# Altium project Master_Project.PrjPcb
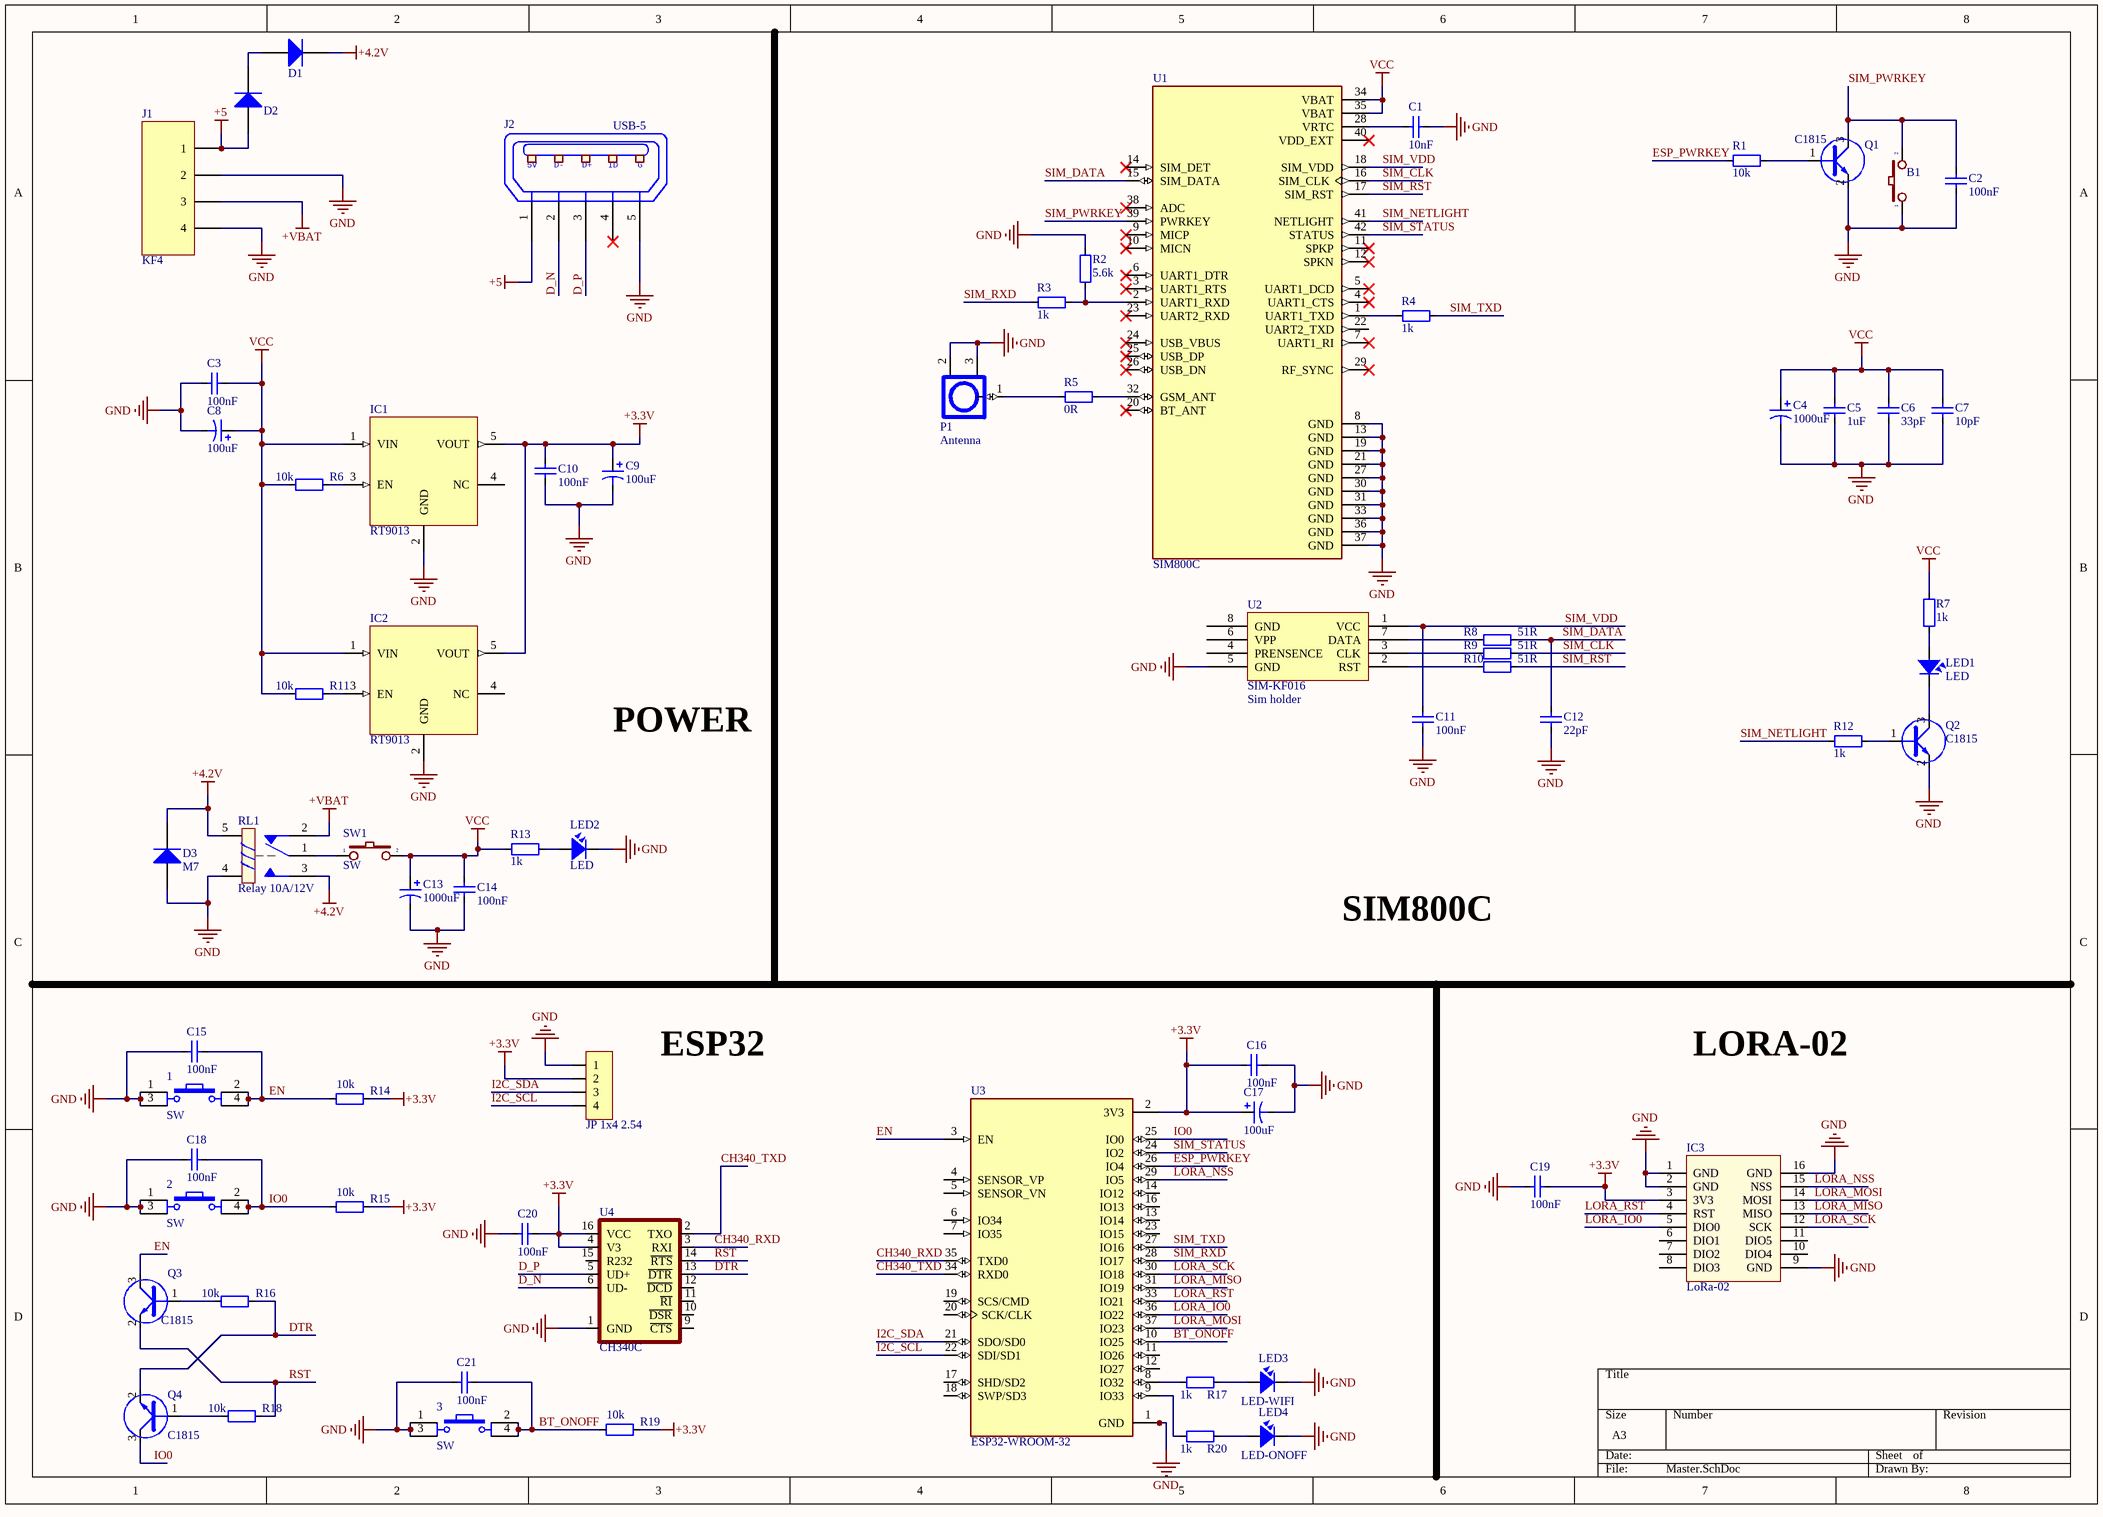
[diagram p0: Master.SchDoc]
1 sheet, 69 parts. Net scope: global (net labels, ports and power ports of the same name join across sheets).
Board file: Master.PcbDoc

## Sheet Master.SchDoc
size A3; SheetNumber: 1; SheetTotal: 1

### Parts
1  SW  [SW4]
2  SW  [SW4]
3  SW  [SW4]
B1  Button 3x4x2.5  [Button 3x4x2.5]  (value not drawn)
C1  10nF  [CAP_0805]
C2  100nF  [CAP_0805]
C3  100nF  [CAP_0805]
C4  1000uF  [C8mm]
C5  1uF  [CAP_0805]
C6  33pF  [CAP_0805]
C7  10pF  [CAP_0805]
C8  100uF  [C5mm]
C9  100uF  [C5mm]
C10  100nF  [CAP_0805]
C11  100nF  [CAP_0805]
C12  22pF  [CAP_0805]
C13  1000uF  [C8mm]
C14  100nF  [CAP_0805]
C15  100nF  [CAP_0805]
C16  100nF  [CAP_0805]
C17  100uF  [C5mm]
C18  100nF  [CAP_0805]
C19  100nF  [CAP_0805]
C20  100nF  [CAP_0805]
C21  100nF  [CAP_0805]
D1  SS34 Diode 3A 40V  [DIODE SMA]  (value not drawn)
D2  SS34 Diode 3A 40V  [DIODE SMA]  (value not drawn)
D3  M7  [DIODE SMA]
IC1  RT9013  [SOT23-5]
IC2  RT9013  [SOT23-5]
IC3  LoRa-02  [LoRa-02]
J1  KF4  [KF4-5.08]
J2  USB-5  [USB-M1]
JP1  JP 1x4 2.54  [JP 1x4 DT]
LED1  LED  [LED-0805-Red]
LED2  LED  [LED-0805-Red]
LED3  LED-WIFI  [LED-0805-Red]
LED4  LED-ONOFF  [LED-0805-Red]
P1  Antenna  [IPXS]
Q1  C1815  [SOT23D]
Q2  C1815  [SOT23D]
Q3  C1815  [SOT23D]
Q4  C1815  [SOT23D]
R1  10k  [RES-SMD-0805]
R2  5.6k  [RES-SMD-0805]
R3  1k  [RES-SMD-0805]
R4  1k  [RES-SMD-0805]
R5  0R  [RES-SMD-0805]
R6  10k  [RES-SMD-0805]
R7  1k  [RES-SMD-0805]
R8  51R  [RES-SMD-0805]
R9  51R  [RES-SMD-0805]
R10  51R  [RES-SMD-0805]
R11  10k  [RES-SMD-0805]
R12  1k  [RES-SMD-0805]
R13  1k  [RES-SMD-0805]
R14  10k  [RES-SMD-0805]
R15  10k  [RES-SMD-0805]
R16  10k  [RES-SMD-0805]
R17  1k  [RES-SMD-0805]
R18  10k  [RES-SMD-0805]
R19  10k  [RES-SMD-0805]
R20  1k  [RES-SMD-0805]
RL1  Relay 10A/12V  [RELAY 5]
SW1  SW  [SW2]
U1  SIM800C  [SIM800C]
U2  SIM-KF016  value Sim holder  [Sim Socket]
U3  ESP32-WROOM-32  [MODULE_ESP32-WROOM-32]
U4  CH340C  [SO016]

### Nets
+3.3V: C9.1 C10.1 C16.1 C17.1 C19.1 C20.2 IC1.5(VOUT) IC2.5(VOUT) IC3.3(3V3) JP1.2 R14.1 R15.1 R19.1 U3.2(3V3) U4.4(V3) U4.16(VCC)
+4.2V: D1.2(K) D3.2(K) RL1.3 RL1.5
+5: D2.1(A) J1.1 J2.1(P1)
+VBAT: J1.3 RL1.2
GND: 1.1 1.3 2.1 2.3 3.1 3.3 B1.1 C1.2 C2.1 C3.2 C4.2 C5.2 C6.2 C7.2 C8.2 C9.2 C10.2 C11.2 C12.1 C13.2 C14.2 C15.1 C16.2 C17.2 C18.1 C19.2 C20.1 C21.1 D3.1(A) IC1.2(GND) IC2.2(GND) IC3.1(GND) IC3.2(GND) IC3.9(GND) IC3.16(GND) J1.2 J1.4 J2.5(P5) JP1.1 LED2.2 LED3.2 LED4.2 P1.2 P1.3 Q1.2(E) Q2.2(E) R2.1 RL1.4 U1.8(GND) U1.13(GND) U1.19(GND) U1.21(GND) U1.27(GND) U1.30(GND) U1.31(GND) U1.33(GND) U1.36(GND) U1.37(GND) U2.5(GND) U3.1(GND) U3.15(GND) U3.38(GND) U3.39_1(GND) U3.39_2(GND) U3.39_3(GND) U3.39_4(GND) U3.39_5(GND) U3.39_6(GND) U3.39_7(GND) U3.39_8(GND) U3.39_9(GND) U3.39_10(GND) U3.39_11(GND) U3.39_12(GND) U3.39_13(GND) U3.39_14(GND) U3.39_15(GND) U3.39_16(GND) U3.39_17(GND) U3.39_18(GND) U3.39_19(GND) U3.39_20(GND) U3.39_21(GND) U4.1(GND)
VCC: C3.1 C4.1 C5.1 C6.1 C7.1 C8.1 C13.1 C14.1 IC1.1(VIN) IC2.1(VIN) R6.2 R7.2 R11.2 R13.2 SW1.2 U1.34(VBAT) U1.35(VBAT)
BT_ONOFF: 3.2 3.4 C21.2 R19.2 U3.10(IO25)
CH340_RXD: U3.35(TXD0) U4.3(RXI)
CH340_TXD: U3.34(RXD0) U4.2(TXO)
D_N: J2.2(P2) U4.6(UD-)
D_P: J2.3(P3) U4.5(UD+)
DTR: Q4.2(E) R16.1 U4.13(~{DTR})
EN: 1.2 1.4 C15.2 Q3.3(C) R14.2 U3.3(EN)
ESP_PWRKEY: R1.1 U3.26(IO4)
I2C_SCL: JP1.4 U3.22(SDI/SD1)
I2C_SDA: JP1.3 U3.21(SDO/SD0)
IO0: 2.2 2.4 C18.2 Q4.3(C) R15.2 U3.25(IO0)
LORA_IO0: IC3.5(DIO0) U3.36(IO22)
LORA_MISO: IC3.13(MISO) U3.31(IO19)
LORA_MOSI: IC3.14(MOSI) U3.37(IO23)
LORA_NSS: IC3.15(NSS) U3.29(IO5)
LORA_RST: IC3.4(RST) U3.33(IO21)
LORA_SCK: IC3.12(SCK) U3.30(IO18)
RST: Q3.2(E) R18.1 U4.14(~{RTS})
SIM_CLK: R9.2 U1.16(SIM_CLK)
SIM_DATA: C12.2 R8.2 U1.15(SIM_DATA)
SIM_NETLIGHT: R12.1 U1.41(NETLIGHT)
SIM_PWRKEY: B1.2 C2.2 Q1.3(C) U1.39(PWRKEY)
SIM_RST: R10.2 U1.17(SIM_RST)
SIM_RXD: R3.1 U3.28(IO17)
SIM_STATUS: U1.42(STATUS) U3.24(IO2)
SIM_TXD: R4.1 U3.27(IO16)
SIM_VDD: C11.1 U1.18(SIM_VDD) U2.1(VCC)
NetC1_1: C1.1 U1.28(VRTC)
NetD1_1: D1.1(A) D2.2(K)
NetIC1_3: IC1.3(EN) R6.1
NetIC2_3: IC2.3(EN) R11.1
NetLED1_1: LED1.1 R7.1
NetLED1_2: LED1.2 Q2.3(C)
NetLED2_1: LED2.1 R13.1
NetLED3_1: LED3.1 R17.1
NetLED4_1: LED4.1 R20.1
NetP1_1: P1.1 R5.2
NetQ1_1: Q1.1(B) R1.2
NetQ2_1: Q2.1(B) R12.2
NetQ3_1: Q3.1(B) R16.2
NetQ4_1: Q4.1(B) R18.2
NetR2_2: R2.2 R3.2 U1.2(UART1_RXD)
NetR4_2: R4.2 U1.1(UART1_TXD)
NetR5_1: R5.1 U1.32(GSM_ANT)
NetR8_1: R8.1 U2.7(DATA)
NetR9_1: R9.1 U2.3(CLK)
NetR10_1: R10.1 U2.2(RST)
NetR17_2: R17.2 U3.8(IO32)
NetR20_2: R20.2 U3.9(IO33)
NetRL1_1: RL1.1 SW1.1

Not connected (* = marked no-connect by the designer): IC1 4(NC); IC2 4(NC); IC3 6(DIO1) 7(DIO2) 8(DIO3) 10(DIO4) 11(DIO5); J2 4(P4)*; U1 3(UART1_RTS)* 4(UART1_CTS)* 5(UART1_DCD)* 6(UART1_DTR)* 7(UART1_RI)* 9(MICP)* 10(MICN)* 11(SPKP)* 12(SPKN)* 14(SIM_DET)* 20(BT_ANT)* 22(UART2_TXD) 23(UART2_RXD)* 24(USB_VBUS)* 25(USB_DP)* 26(USB_DN)* 29(RF_SYNC)* 38(ADC)* 40(VDD_EXT)*; U2 4(PRENSENCE) 6(VPP) 8(GND); U3 4(SENSOR_VP) 5(SENSOR_VN) 6(IO34) 7(IO35) 11(IO26) 12(IO27) 13(IO14) 14(IO12) 16(IO13) 17(SHD/SD2) 18(SWP/SD3) 19(SCS/CMD) 20(SCK/CLK) 23(IO15); U4 9(~{CTS}) 10(~{DSR}) 11(~{RI}) 12(~{DCD}) 15(R232)

### Notes on the sheet
- POWER
- SIM800C
- ESP32
- LORA-02
- (in symbol USB-5) 5V; D-; D+; ID; G

### Library data of the parts
1-3 = SW4: Switch button 4 pin; Value: Button chip 4 pin
C1-C3 C5-C7 C10-C12 C14-C16 C18-C21 = CapSMD: Capacitor; Value: 33p; Published: 8-Jun-2000; LatestRevisionDate: 17-Jul-2002; LatestRevisionNote: Re-released for DXP Platform.; PackageReference: RAD-0.3; Publisher: Altium Limited
C4 C13 = Cap Pol: 1000uF 16V 8x16mm; Published: 8-Jun-2000; LatestRevisionDate: 17-Jul-2002; LatestRevisionNote: Re-released for DXP Platform.; PackageReference: POLAR0.8; Publisher: Altium Limited
C8 C9 C17 = Cap Pol: 100uF 16V; Published: 8-Jun-2000; LatestRevisionDate: 17-Jul-2002; LatestRevisionNote: Re-released for DXP Platform.; PackageReference: POLAR0.8; Publisher: Altium Limited
D1-D3 = Diode M7 ( 4007 ): Dán; Don_Vi: Con; Ten_Linh_Kien: Diode M7 1N4007 SMD 1A 1000V; Ma_Hang: MH000944; Chung_Loai: Dán; Ghi_Chu: *
IC1 IC2 = RT9013: RT9013-33GB IC REG LINEAR 3.3V 500mA SOT23-5
J1 = KF4: Manufacturer: W¨¹rth Elektronik eiSos GmbH; PartNo: 691133710004; ComponentLink1 Description: Manufacturer; ComponentLink2 Description: Datasheet; NoPins: 4; ComponentLink1 URL: http://www.we-online.com; ComponentLink2 URL: http://katalog.we-online.de/em/datasheet/6911337100xx.pdf; Created By: Baojun Chen; Created Date: 4-Aug-15
J2 = USB-5: Manufacturer: FCI; Manufacturer Part Number: 10118193-0001LF; Connector Type: USB - micro B; Number of Contacts: 5; Gender: Receptacle; Specifications: USB 2.0; .Creator: MM; .Checked PCB: RF; Supplier 1: Digi-Key; RoHS: RoHS Compliant; Category: Connectors, Interconnects; Stock 1: 28642; Pricing 1: 1=0.46, 10=0.433, 25=0.3712, 50=0.3156, 100=0.3032, 250=0.27224, 500=0.25988 (USD); Packaging: Cut Tape (CT); Mounting Type: Surface Mount, Right Angle, Horizontal; Features: Shielded, Solder Retention; Ingress Protection: -; ComponentLink1URL: http://portal.fciconnect.com/Comergent//fci/drawing/10118193.pdf; ComponentLink1Description: http://portal.fciconnect.com/Comergent//fci/drawing/10118193.pdf; Supplier Part Number 1: 609-4616-1-ND; .Checked SCH: MM
JP1 = JP 1x4 2.54 Duc Thang: Cắm; Ten_Linh_Kien: Jump Đơn Đực 2.54MM 1x40P Thẳng 11MM; Don_Vi: Con; Ma_Hang: MH000903; Ghi_Chu: *; Kieu_Chan: *; Chung_Loai: Cắm
LED1-LED4 = LED: LED Single colour Green and Red; Value: LED 3 ly Single Colour
P1 = IPXSx66: Antenna GSM GPS
Q1-Q4 = 2SC1815: NPN 600mW, ECB; Value: C1815
R1-R20 = Resistor - SMD: Resistor; Manufacturer: Generic Components; Class: Passive; Published: 08/06/2000; Publisher: Altium Hobart Technology Centre
RL1 = Relay 5: Relay SPDT,10A - 12VDC 5 Pin; Value: Relay SPDT, 10A, 12V
SW1 = SW2: Switch button 2 pin; Value: SW chip 2 pin
U2 = Sim holder: SIM Card Holder KF-016
U3 = ESP32-WROOM-32: Bluetooth, WiFi Transceiver Module 2.4GHz ~ 2.5GHz Surface Mount; MF: Espressif Systems; Package: Module Espressif Systems; Digi-Key_Part_Number: 1904-1010-1-ND; Digi-Key_Purchase_URL: https://www.digikey.com/product-detail/en/espressif-systems/ESP32-WROOM-32/1904-1010-1-ND/8544305?utm_source=snapeda&utm_medium=aggregator&utm_campaign=symbol; Value: *; MP: ESP32-WROOM-32; SnapEDA_Link: https://www.snapeda.com/parts/ESP32-WROOM-32/Espressif%20Systems/view-part/2753322/?ref=snap
U4 = CH340C: USB to serial chip CH340; MF: WCH; Package: Package; Check_prices: https://www.snapeda.com/parts/CH340C/WCH/view-part/5428851/?ref=eda; Value: *; Price: None; MP: CH340C; Availability: Unavailable; SnapEDA_Link: https://www.snapeda.com/parts/CH340C/WCH/view-part/5428851/?ref=snap